# Altium schematic sheet canstop_2024-11-13.schdoc
size 301 x 194 mm
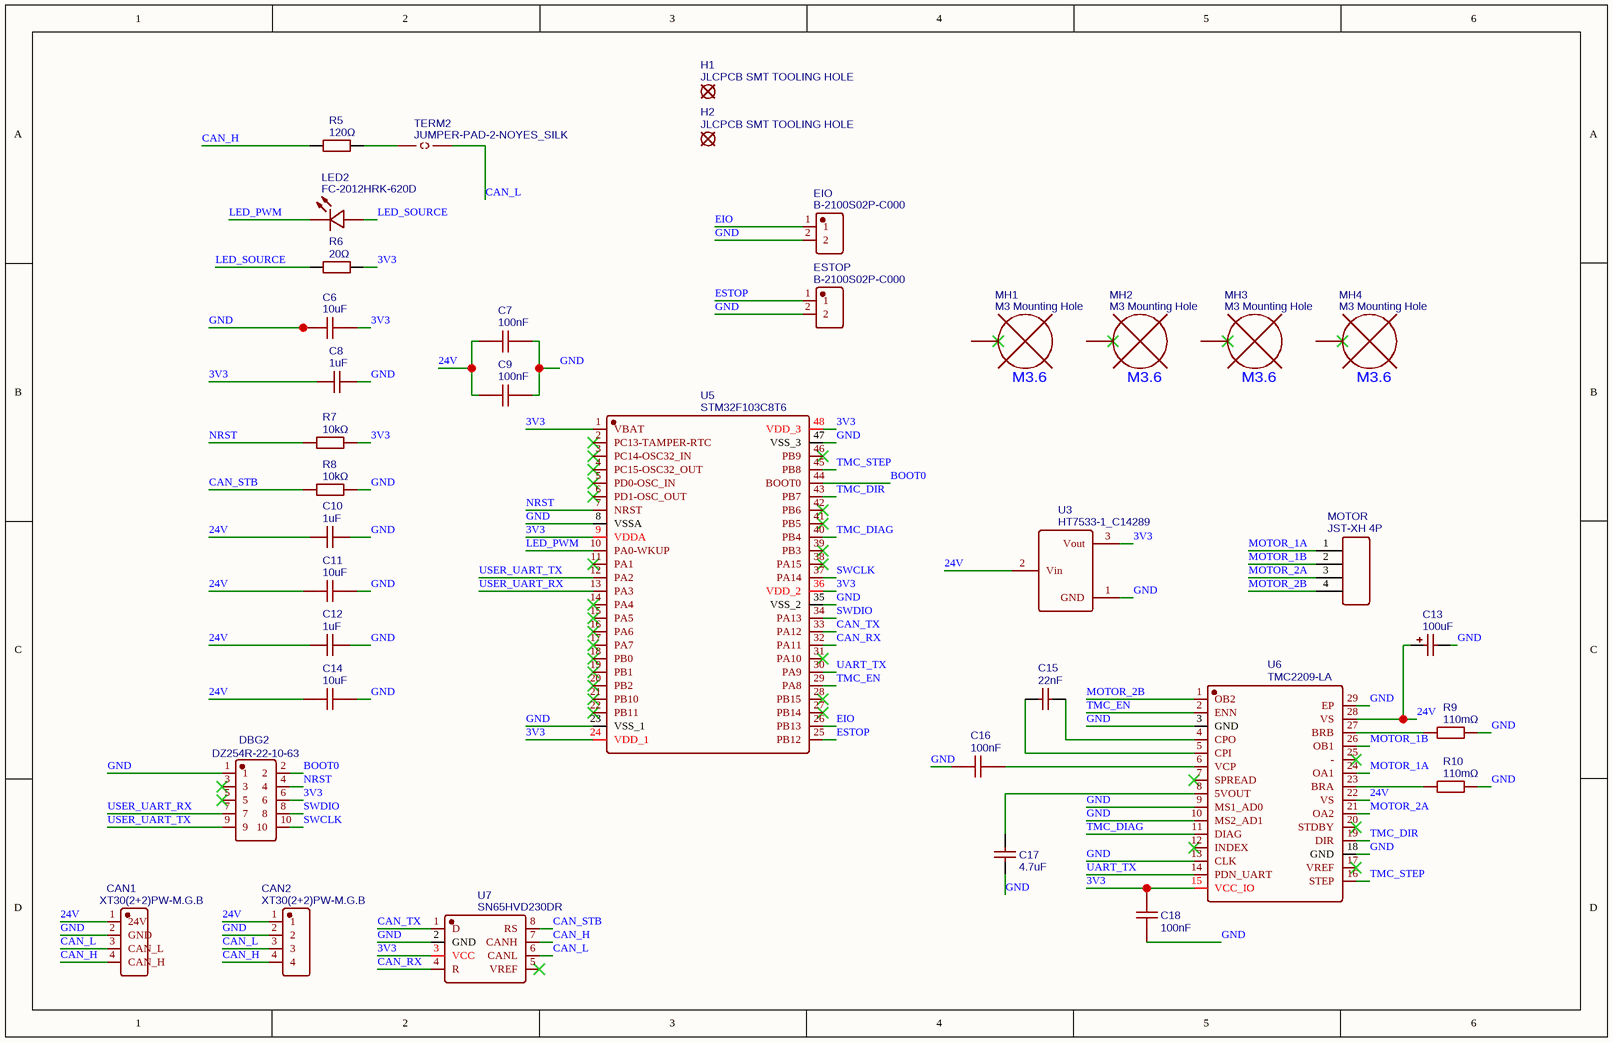
[diagram p0: canstop_2024-11-13.schdoc]

## Parts
C6  10uF  [C0805]
C7  100nF  [C0805]
C8  1uF  [C0805]
C9  100nF  [C0805]
C10  1uF  [C0805]
C11  10uF  [C0805]
C12  1uF  [C0805]
C13  100uF  [CAP-SMD_L7.3-W4.3]
C14  10uF  [C0805]
C15  22nF  [C0603]
C16  100nF  [C0603]
C17  4.7uF  [C0603]
C18  100nF  [C0603]
CAN1  XT30(2+2)PW-M.G.B  [XT30(2+2)_NO_TAB]
CAN2  XT30(2+2)PW-M.G.B  [XT30(2+2)_NO_TAB]
DBG2  DZ254R-22-10-63  [HDR-TH_10P-P2.54-V-M-R2-C5-S2.54]
EIO  B-2100S02P-C000  [HDR-TH_2P-P2.54-V-M]
ESTOP  B-2100S02P-C000  [HDR-TH_2P-P2.54-V-M]
H1  JLCPCB SMT TOOLING HOLE  [JLCPCB_SMT_TOOLING_HOLE]
H2  JLCPCB SMT TOOLING HOLE  [JLCPCB_SMT_TOOLING_HOLE]
LED2  FC-2012HRK-620D  [LED0805-R-RD]
MH1  M3 Mounting Hole  [MOUNTING-HOLE-3.6MM-X-5.8MM]
MH2  M3 Mounting Hole  [MOUNTING-HOLE-3.6MM-X-5.8MM]
MH3  M3 Mounting Hole  [MOUNTING-HOLE-3.6MM-X-5.8MM]
MH4  M3 Mounting Hole  [MOUNTING-HOLE-3.6MM-X-5.8MM]
MOTOR  JST-XH 4P  [JST-XH-04-PACKAGE-ROUND-PAD]
R5  120Ω  [R0805]
R6  20Ω  [R0805]
R7  10kΩ  [R0805]
R8  10kΩ  [R0805]
R9  110mΩ  [R1210]
R10  110mΩ  [R1210]
TERM2  JUMPER-PAD-2-NOYES_SILK  [PAD-JUMPER-2-NO_YES_SILK]
U3  HT7533-1_C14289  [SOT-89-3_L4.5-W2.5-P1.50-LS4.2-BR]
U5  STM32F103C8T6  [LQFP-48_L7.0-W7.0-P0.50-LS9.0-BL]
U6  TMC2209-LA  [QFN-28_L5.0-W5.0-P0.50-BL-EP]
U7  SN65HVD230DR  [SOIC-8_L4.9-W3.9-P1.27-LS6.0-BL]

## Nets
3V3: C6.2 C8.1 C18.2 DBG2.6 R6.2 R7.2 U3.3(Vout) U5.1(VBAT) U5.9(VDDA) U5.24(VDD_1) U5.36(VDD_2) U5.48(VDD_3) U6.15(VCC_IO) U7.3(VCC)
24V: C7.1 C9.1 C10.1 C11.1 C12.1 C13.1 C14.1 CAN1.1(24V) CAN2.1 U3.2(Vin) U6.22(VS) U6.28(VS)
BOOT0: DBG2.2 U5.44(BOOT0)
CAN_H: CAN1.4(CAN_H) CAN2.4 R5.1 U7.7(CANH)
CAN_L: CAN1.3(CAN_L) CAN2.3 TERM2.2 U7.6(CANL)
CAN_RX: U5.32(PA11) U7.4(R)
CAN_STB: R8.1 U7.8(RS)
CAN_TX: U5.33(PA12) U7.1(D)
EIO: EIO.1 U5.26(PB13)
ESTOP: ESTOP.1 U5.25(PB12)
GND: C6.1 C7.2 C8.2 C9.2 C10.2 C11.2 C12.2 C13.2 C14.2 C16.1 C17.1 C18.1 CAN1.2(GND) CAN2.2 DBG2.1 EIO.2 ESTOP.2 R8.2 R9.2 R10.2 U3.1(GND) U5.8(VSSA) U5.23(VSS_1) U5.35(VSS_2) U5.47(VSS_3) U6.3(GND) U6.9(MS1_AD0) U6.10(MS2_AD1) U6.13(CLK) U6.18(GND) U6.29(EP) U7.2(GND)
LED_PWM: LED2.2(-) U5.10(PA0-WKUP)
LED_SOURCE: LED2.1(+) R6.1
MOTOR_1A: MOTOR.1 U6.24(OA1)
MOTOR_1B: MOTOR.2 U6.26(OB1)
MOTOR_2A: MOTOR.3 U6.21(OA2)
MOTOR_2B: MOTOR.4 U6.1(OB2)
NRST: DBG2.4 R7.1 U5.7(NRST)
SWCLK: DBG2.10 U5.37(PA14)
SWDIO: DBG2.8 U5.34(PA13)
TMC_DIAG: U5.40(PB4) U6.11(DIAG)
TMC_DIR: U5.43(PB7) U6.19(DIR)
TMC_EN: U5.29(PA8) U6.2(ENN)
TMC_STEP: U5.45(PB8) U6.16(STEP)
UART_TX: U5.30(PA9) U6.14(PDN_UART)
USER_UART_RX: DBG2.7 U5.13(PA3)
USER_UART_TX: DBG2.9 U5.12(PA2)
NetC15_1: C15.1 U6.5(CPI)
NetC15_2: C15.2 U6.4(CPO)
NetC16_2: C16.2 U6.6(VCP)
NetC17_2: C17.2 U6.8(5VOUT)
NetR5_2: R5.2 TERM2.1
NetR9_1: R9.1 U6.27(BRB)
NetR10_1: R10.1 U6.23(BRA)

Not connected (* = marked no-connect by the designer): DBG2 3* 5*; MH1 1*; MH2 1*; MH3 1*; MH4 1*; U5 2(PC13-TAMPER-RTC)* 3(PC14-OSC32_IN)* 4(PC15-OSC32_OUT)* 5(PD0-OSC_IN)* 6(PD1-OSC_OUT)* 11(PA1)* 14(PA4)* 15(PA5)* 16(PA6)* 17(PA7)* 18(PB0)* 19(PB1)* 20(PB2)* 21(PB10)* 22(PB11)* 27(PB14)* 28(PB15)* 31(PA10)* 38(PA15)* 39(PB3)* 41(PB5)* 42(PB6)* 46(PB9)*; U6 7(SPREAD)* 12(INDEX)* 17(VREF)* 20(STDBY)* 25(-)*; U7 5(VREF)*

## Notes on the sheet
- (in symbol M3 Mounting Hole) M3.6

## Library data of the parts
C6 C11 C14 = 10uF: Manufacturer Part: CL21A106KAYNNNE; Manufacturer: SAMSUNG(三星); nameAlias: Value; Supplier: LCSC; Supplier Part: C15850; JLCPCB Part Class: Basic Part; spicePre: C; spiceSymbolName: CL21A106KAYNNNE
C7 C9 = 100nF: Manufacturer Part: CC0805KRX7R9BB104; Manufacturer: YAGEO(国巨); nameAlias: Value; Supplier: LCSC; Supplier Part: C49678; JLCPCB Part Class: Basic Part; spicePre: C; spiceSymbolName: CC0805KRX7R9BB104
C8 C10 C12 = 1uF: Manufacturer Part: CL21B105KBFNNNE; Manufacturer: SAMSUNG(三星); nameAlias: Value; Supplier: LCSC; Supplier Part: C28323; JLCPCB Part Class: Basic Part; link: https://lcsc.com/eda_search?q=C28323&%26type=1&ref=editor; spicePre: C; spiceSymbolName: CL21B105KBFNNNE
C13 = 100uF: Manufacturer: KEMET(基美); Manufacturer Part: T491X107M025AT; nameAlias: Value; Contributor: LCSC; Supplier: LCSC; Supplier Part: C127835; JLCPCB Part Class: Extended Part; spicePre: C; spiceSymbolName: T491X107M025AT
C15 = 22nF: Manufacturer Part: CL10B223KB8NNNC; Manufacturer: SAMSUNG(三星); nameAlias: Value; Supplier: LCSC; Supplier Part: C21122; JLCPCB Part Class: Basic Part; spicePre: C; spiceSymbolName: CL10B223KB8NNNC
C16 C18 = 100nF: Manufacturer: YAGEO(国巨); Manufacturer Part: CC0603KRX7R9BB104; nameAlias: Value; Supplier: LCSC; Supplier Part: C14663; JLCPCB Part Class: Basic Part; spicePre: C; spiceSymbolName: CC0603KRX7R9BB104
C17 = 4.7uF: Manufacturer Part: CL10A475KO8NNNC; Manufacturer: SAMSUNG(三星); nameAlias: Value; Supplier: LCSC; Supplier Part: C19666; JLCPCB Part Class: Basic Part; spicePre: C; spiceSymbolName: CL10A475KO8NNNC
CAN1 CAN2 = XT30(2+2)PW-M.G.B: Manufacturer: AMASS(艾迈斯); Contributor: chathamja; Supplier: LCSC; Supplier Part: C19268030; Manufacturer Part: XT30(2+2)PW-M.G.B; spicePre: U; spiceSymbolName: XT30(2+2)PW-M.G.B
DBG2 = DZ254R-22-10-63: Manufacturer: DEALON(德艺隆); Contributor: LCSC; Supplier: LCSC; Supplier Part: C2935920; Manufacturer Part: DZ254R-22-10-63; JLCPCB Part Class: Extended Part; spicePre: H; spiceSymbolName: DZ254R-22-10-63
EIO ESTOP = B-2100S02P-C000: Manufacturer: Ckmtw(灿科盟); Contributor: LCSC; Supplier: LCSC; Supplier Part: C2902690; Manufacturer Part: B-2100S02P-C000; JLCPCB Part Class: Extended Part; spicePre: H; spiceSymbolName: B-2100S02P-C000
H1 H2 = JLCPCB SMT TOOLING HOLE: Contributor: Sindel90; Supplier Part: x; spicePre: H; spiceSymbolName: JLCPCB SMT TOOLING HOLE
LED2 = FC-2012HRK-620D: Manufacturer: 国星光电; Manufacturer Part: NCD0805R1; Supplier: LCSC; Supplier Part: C84256; JLCPCB Part Class: Basic Part; spicePre: L; spiceSymbolName: FC-2012HRK-620D
MH1-MH4 = M3 Mounting Hole: Contributor: StefMas; spicePre: M; spiceSymbolName: M3 Mounting Hole
MOTOR = JST-XH 4P: Contributor: ordialesjeremiah; spicePre: J; spiceSymbolName: JST-XH 4P EURORACK POWER COPY
R5 = 120Ω: Manufacturer: UNI-ROYAL(厚声); Manufacturer Part: 0805W8F1200T5E; nameAlias: Value; Supplier: LCSC; Supplier Part: C17437; JLCPCB Part Class: Basic Part; spicePre: R; spiceSymbolName: 0805W8F1200T5E
R6 = 20Ω: Manufacturer: UNI-ROYAL(厚声); Manufacturer Part: 0805W8F200JT5E; nameAlias: Value; Supplier: LCSC; Supplier Part: C17544; JLCPCB Part Class: Basic Part; spicePre: R; spiceSymbolName: 0805W8F200JT5E
R7 R8 = 10kΩ: Manufacturer: UNI-ROYAL(厚声); Manufacturer Part: 0805W8F1002T5E; nameAlias: Value; Supplier: LCSC; Supplier Part: C17414; JLCPCB Part Class: Basic Part; link: https://lcsc.com/eda_search?q=C17414&%26type=1&ref=editor; spicePre: R; spiceSymbolName: 0805W8F1002T5E
R9 R10 = 110mΩ: Manufacturer: RALEC(旺诠); Manufacturer Part: RTT12R110FTP; nameAlias: Value; Contributor: LCSC; Supplier: LCSC; Supplier Part: C159300; JLCPCB Part Class: Extended Part; spicePre: R; spiceSymbolName: RTT12R110FTP
TERM2 = JUMPER-PAD-2-NOYES_SILK: Contributor: SparkFun; spicePre: S; spiceSymbolName: JUMPER-PAD-2-NOYES_SILK
U3 = HT7533-1_C14289: Manufacturer: HOLTEK(合泰/盛群); Supplier: LCSC; Manufacturer Part: HT7533-1; Supplier Part: C14289; JLCPCB Part Class: Basic Part; spicePre: U; spiceSymbolName: HT7533-1_C14289
U5 = STM32F103C8T6: Manufacturer: ST(意法半导体); timeStamp: 1455028086; Supplier: LCSC; Manufacturer Part: STM32F103C8T6; Supplier Part: C8734; JLCPCB Part Class: Extended Part; spicePre: U; spiceSymbolName: STM32F103C8T6
U6 = TMC2209-LA: Manufacturer: TRINAMIC; Contributor: LCSC; Supplier: LCSC; Supplier Part: C465949; Manufacturer Part: TMC2209-LA; JLCPCB Part Class: Extended Part; spicePre: U; spiceSymbolName: TMC2209-LA
U7 = SN65HVD230DR: Manufacturer: TI(德州仪器); Supplier: LCSC; Manufacturer Part: SN65HVD230DR; Supplier Part: C12084; JLCPCB Part Class: Extended Part; spicePre: U; spiceSymbolName: SN65HVD230DR